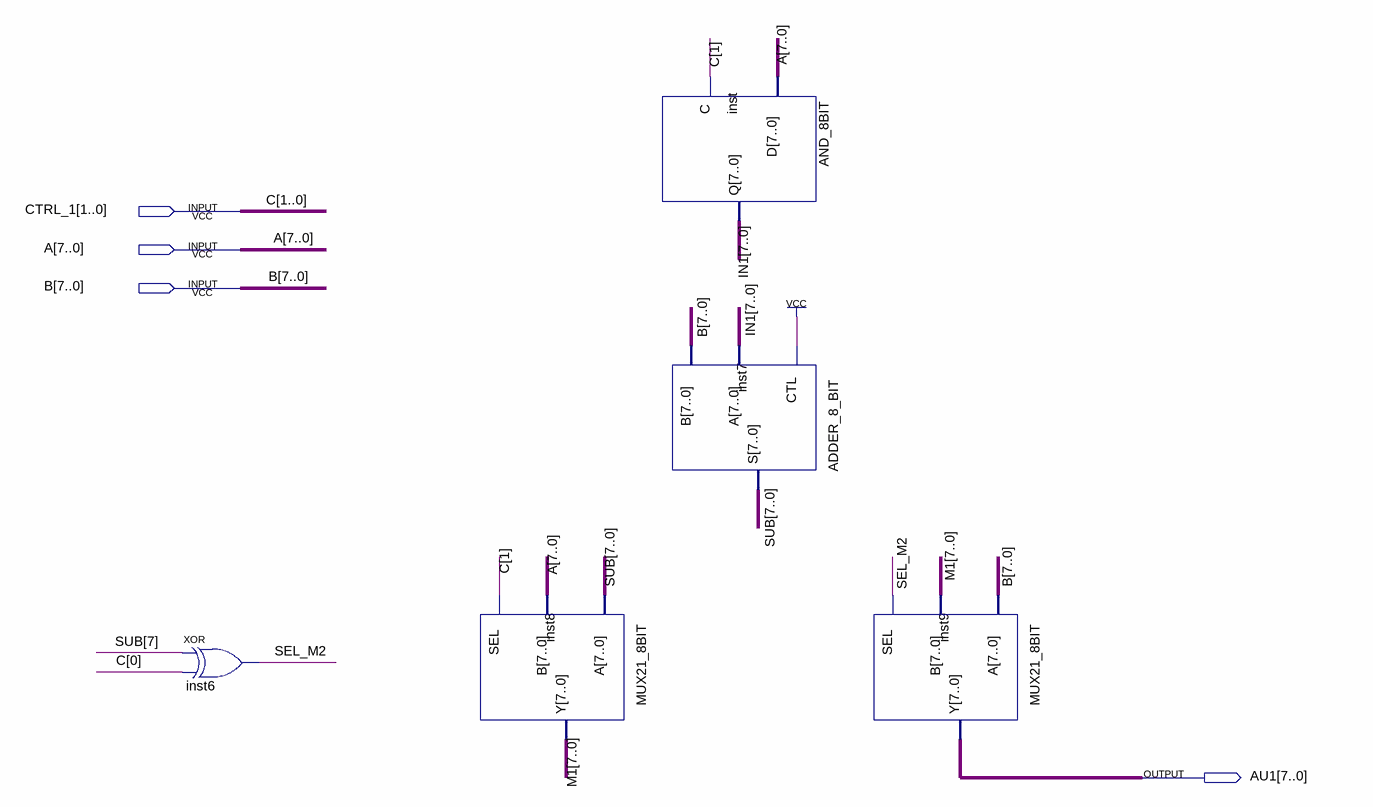
[diagram p0: schematic sheet]
// Quartus schematic AU1.bdf as structural Verilog: 5 symbols, 4 pins
module AU1 (
  input  [1:0] CTRL_1,
  input  [7:0] A,
  input  [7:0] B,
  output [7:0] AU1
);

  wire SEL_M2;
  wire [7:0] IN1, M1, SUB;

  xor inst6 (SEL_M2, SUB[7], CTRL_1[0]);
  MUX21_8BIT inst8 (.A(SUB), .B(A), .SEL(CTRL_1[1]), .Y(M1));
  AND_8BIT inst (.D(A), .C(CTRL_1[1]), .Q(IN1));
  ADDER_8_BIT inst7 (.CTL(1'b1), .A(IN1), .B(B), .S(SUB));
  MUX21_8BIT inst9 (.A(B), .B(M1), .SEL(SEL_M2), .Y(AU1));

  // Other names for the same wires on the sheet: C[1:0] = CTRL_1
endmodule
